# Altium schematic sheet USB_Power_3V3_Regulator.SchDoc
size 199 x 149 mm; SheetNumber: 1; SheetTotal: 2
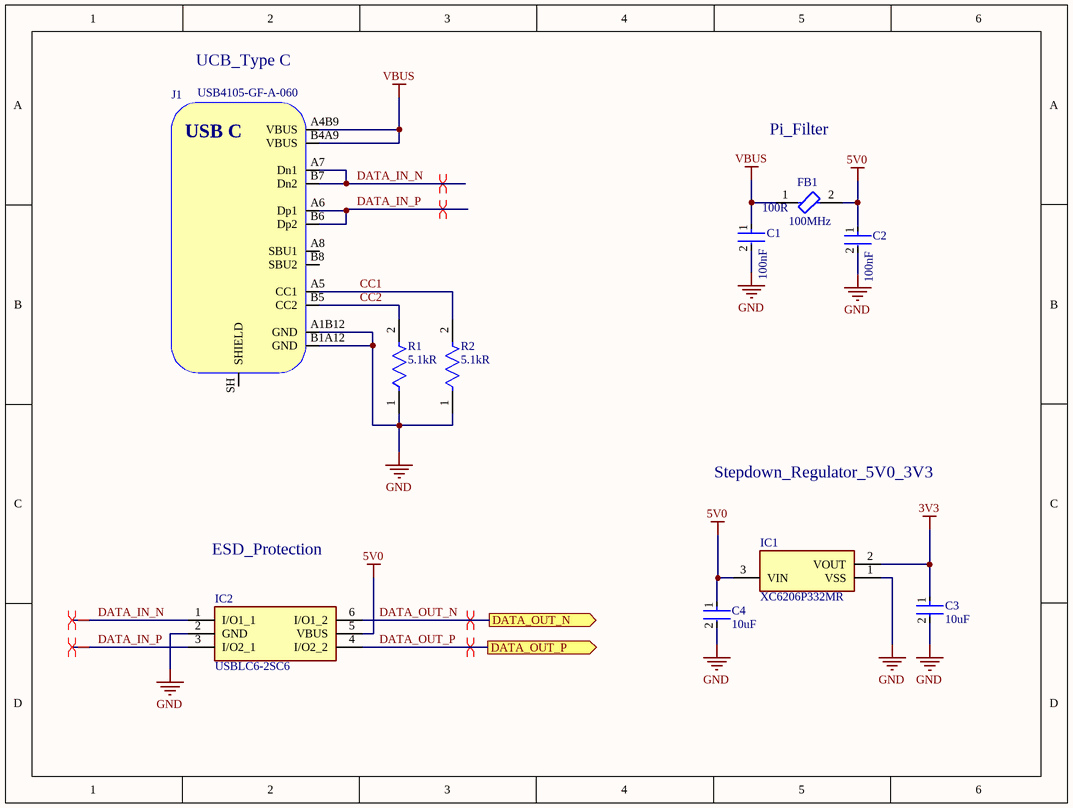
[diagram p0: USB_Power_3V3_Regulator.SchDoc]

## Parts
C1  Capacitance: 100nF  [FP-CL46-IPC_C]  (hidden comment: CL05A104KP5NNNC)
C2  Capacitance: 100nF  [FP-CL46-IPC_C]  (hidden comment: CL05A104KP5NNNC)
C3  Capacitance: 10uF  [FP-1206-L_3_2_0_2-W_1_6_0-IPC_A]  (hidden comment: 1206ZD106KAT2A)
C4  Capacitance: 10uF  [FP-1206-L_3_2_0_2-W_1_6_0-IPC_A]  (hidden comment: 1206ZD106KAT2A)
FB1  Impedance: 100R  Test Frequency: 100MHz  [FP-BLM18-0_15-t0_5-MFG]  (hidden comment: BLM18EG101TN1D)
IC1  XC6206P332MR  [SOT95P280X130-3N]
IC2  USBLC6-2SC6  [SOT95P280X145-6N]
J1  USB4105-GF-A-060  [USB4105-GF-A-060]
R1  Resistance: 5.1kR  [FP-CRCW0402-e3-IPC_A]  (hidden comment: CRCW04025K10FKED)
R2  Resistance: 5.1kR  [FP-CRCW0402-e3-IPC_A]  (hidden comment: CRCW04025K10FKED)

## Ports
DATA_OUT_N (out, see STM32_ nRF24GHz[1B]), DATA_OUT_P (out, see STM32_ nRF24GHz[1B])

## Nets
3V3: C3.1 IC1.2(VOUT)
5V0: C2.1 C4.1 FB1.2 IC1.3(VIN) IC2.5(VBUS)
GND: C1.2 C2.2 C3.2 C4.2 IC1.1(VSS) IC2.2(GND) J1.A1B12(GND) J1.B1A12(GND) R1.1 R2.1
VBUS: C1.1 FB1.1 J1.A4B9(VBUS) J1.B4A9(VBUS)
CC1: J1.A5(CC1) R2.2
CC2: J1.B5(CC2) R1.2
DATA_IN_N: IC2.1(I/O1_1) J1.A7(Dn1) J1.B7(Dn2)
DATA_IN_P: IC2.3(I/O2_1) J1.A6(Dp1) J1.B6(Dp2)
DATA_OUT_N: IC2.6(I/O1_2) ; port DATA_OUT_N
DATA_OUT_P: IC2.4(I/O2_2) ; port DATA_OUT_P

Not connected (* = marked no-connect by the designer): J1 A8(SBU1) B8(SBU2) SH(SHIELD)

## Layout directives
differential pair: DATA_IN_N, DATA_IN_P, DATA_OUT_N, DATA_OUT_P

## Notes on the sheet
- UCB_Type C
- Pi_Filter
- Stepdown_Regulator_5V0_3V3
- ESD_Protection
- (in symbol USB4105-GF-A-060) USB C

## Library data of the parts
C1 C2 = CMP-13271-002143-1: Cap Ceramic 100nF 10V X5R ±10% SMD 0402 +85°C Paper T/R; Depth: 0.5mm; Height: 0.5mm; Case/Package: 0402; Case Code (Imperial): 0402; Contact Plating: Tin; Packaging: Tape and Reel; Case Code (Metric): 1005; Dielectric: X5R; Mount: Surface Mount; Max Operating Temperature: 85°C; Voltage Rating: 10V; Radiation Hardening: No; Length: 1mm; Min Operating Temperature: -55°C; Width: 0.02inch; Tolerance: 10%; Thickness: 0.022inch
C3 C4 = CMP-04427-021870-1: General Purpose Ceramic Capacitor, 1206, 10uF, 10%, X5R, 15%, 10V; Tolerance: 10%; Thickness: 0.07inch; Voltage: 10V; Termination: SMD/SMT; REACH SVHC: No SVHC; Radiation Hardening: No; Lead Free: Lead Free; Min Operating Temperature: -55°C; Contact Plating: Tin; Length: 3.2mm; Dielectric: X5R; Packaging: Tape and Reel; Construction: Flat; RoHS Compliant: Yes; Series: -; Voltage Rating: 10V; Height: 0.07mm; Width: 0.063inch; Voltage Rating (DC): 10V; Mount: Surface Mount; Depth: 1.6mm; Number of Pins: 2; Case Code (Imperial): 1206; Size: 1.78mm; Case/Package: 1206; Max Operating Temperature: 85°C; Package Quantity: 1; Case Code (Metric): 3216
FB1 = CMP-0686-00530-3: Chip Ferrite Bead, 0603, 100Ω @ 100MHz, 25%, 0.045Ω, 2A; DC Resistance (DCR): 45mR; Number of Circuits: 1; Max Current Rating: 2A; Depth: 0.8mm; Case Code (Imperial): 0603; Tolerance: 25%; Packaging: Tape and Reel; Core Material: Ferrite; Material: Ferrite; Termination: SMD/SMT; Case Code (Metric): 1608; Package Quantity: 1; Length: 1.6mm; Contact Plating: Tin; Lead Free: Lead Free; Max Operating Temperature: 125°C; Height: 0.8mm; Current Rating: 2A; REACH SVHC: No SVHC; Max DC Current: 2A; Min Operating Temperature: -55°C; Case/Package: 0603; Number of Pins: 2; Width: 0.8mm; Number of Lines: 1
IC1 = XC6206P332MR: Integrated Circuit; Manufacturer_Name: Torex; Datasheet Link: http://www.torexsemi.com/products/voltage_regulators/data/XC6206.pdf; Height: 1.3mm; Manufacturer_Part_Number: XC6206P332MR; Mouser Part Number: N/A; Mouser Price/Stock: https://www.mouser.co.uk/ProductDetail/Torex-Semiconductor/XC6206P332MR?qs=TiOZkKH1s2Qxu69VLzzkSQ%3D%3D
IC2 = USBLC6-2SC6: Integrated Circuit; Manufacturer_Name: STMicroelectronics; Datasheet Link: http://www.st.com/st-web-ui/static/active/en/resource/technical/document/datasheet/CD00050750.pdf; Height: 1.45mm; Manufacturer_Part_Number: USBLC6-2SC6; Mouser Part Number: 511-USBLC6-2SC6; Mouser Price/Stock: https://www.mouser.co.uk/ProductDetail/STMicroelectronics/USBLC6-2SC6?qs=po45yt2pPpu%2FhNIlwQdTlg%3D%3D; Arrow Part Number: USBLC6-2SC6; Arrow Price/Stock: https://www.arrow.com/en/products/usblc6-2sc6/stmicroelectronics?utm_currency=USD&region=europe
J1 = USB4105-GF-A-060: USB Connector Type C SMT 12 Pin; Manufacturer: GCT; Manufacturer Part Number: USB4105-GF-A-060; Distributor Link: https://eu.mouser.com/ProductDetail/GCT/USB4105-GF-A-060?qs=QNEnbhJQKvY2mocwNJzgfA%3D%3D
R1 R2 = CMP-1011-00590-4: RES Thick Film, 5.1kΩ, 1%, 0.063W, 100ppm/°C, 0402; Voltage Rating: 50V; Max Power Dissipation: 63mW; Case/Package: 0402; Min Operating Temperature: -55°C; Height: 0.35mm; Contact Plating: Tin; Tolerance: 1%; Max Operating Temperature: 155°C; Lead Free: Lead Free; Number of Terminations: 2; Temperature Coefficient: 100ppm/°C; Weight: 2.3E-05oz; Termination: SMD/SMT; Radiation Hardening: No; Voltage Rating (DC): 50V; Length: 1mm; Features: Automotive AEC-Q200; Case Code (Metric): 1005; Width: 0.02inch; Package Quantity: 10; Military Standard: Not; Depth: 0.5mm; Packaging: Tape and Reel; Power Rating: 63mW; Case Code (Imperial): 0402; Composition: Thick Film